# EAGLE design nano_bluetooth4_3.3v (EAGLE 6.1)
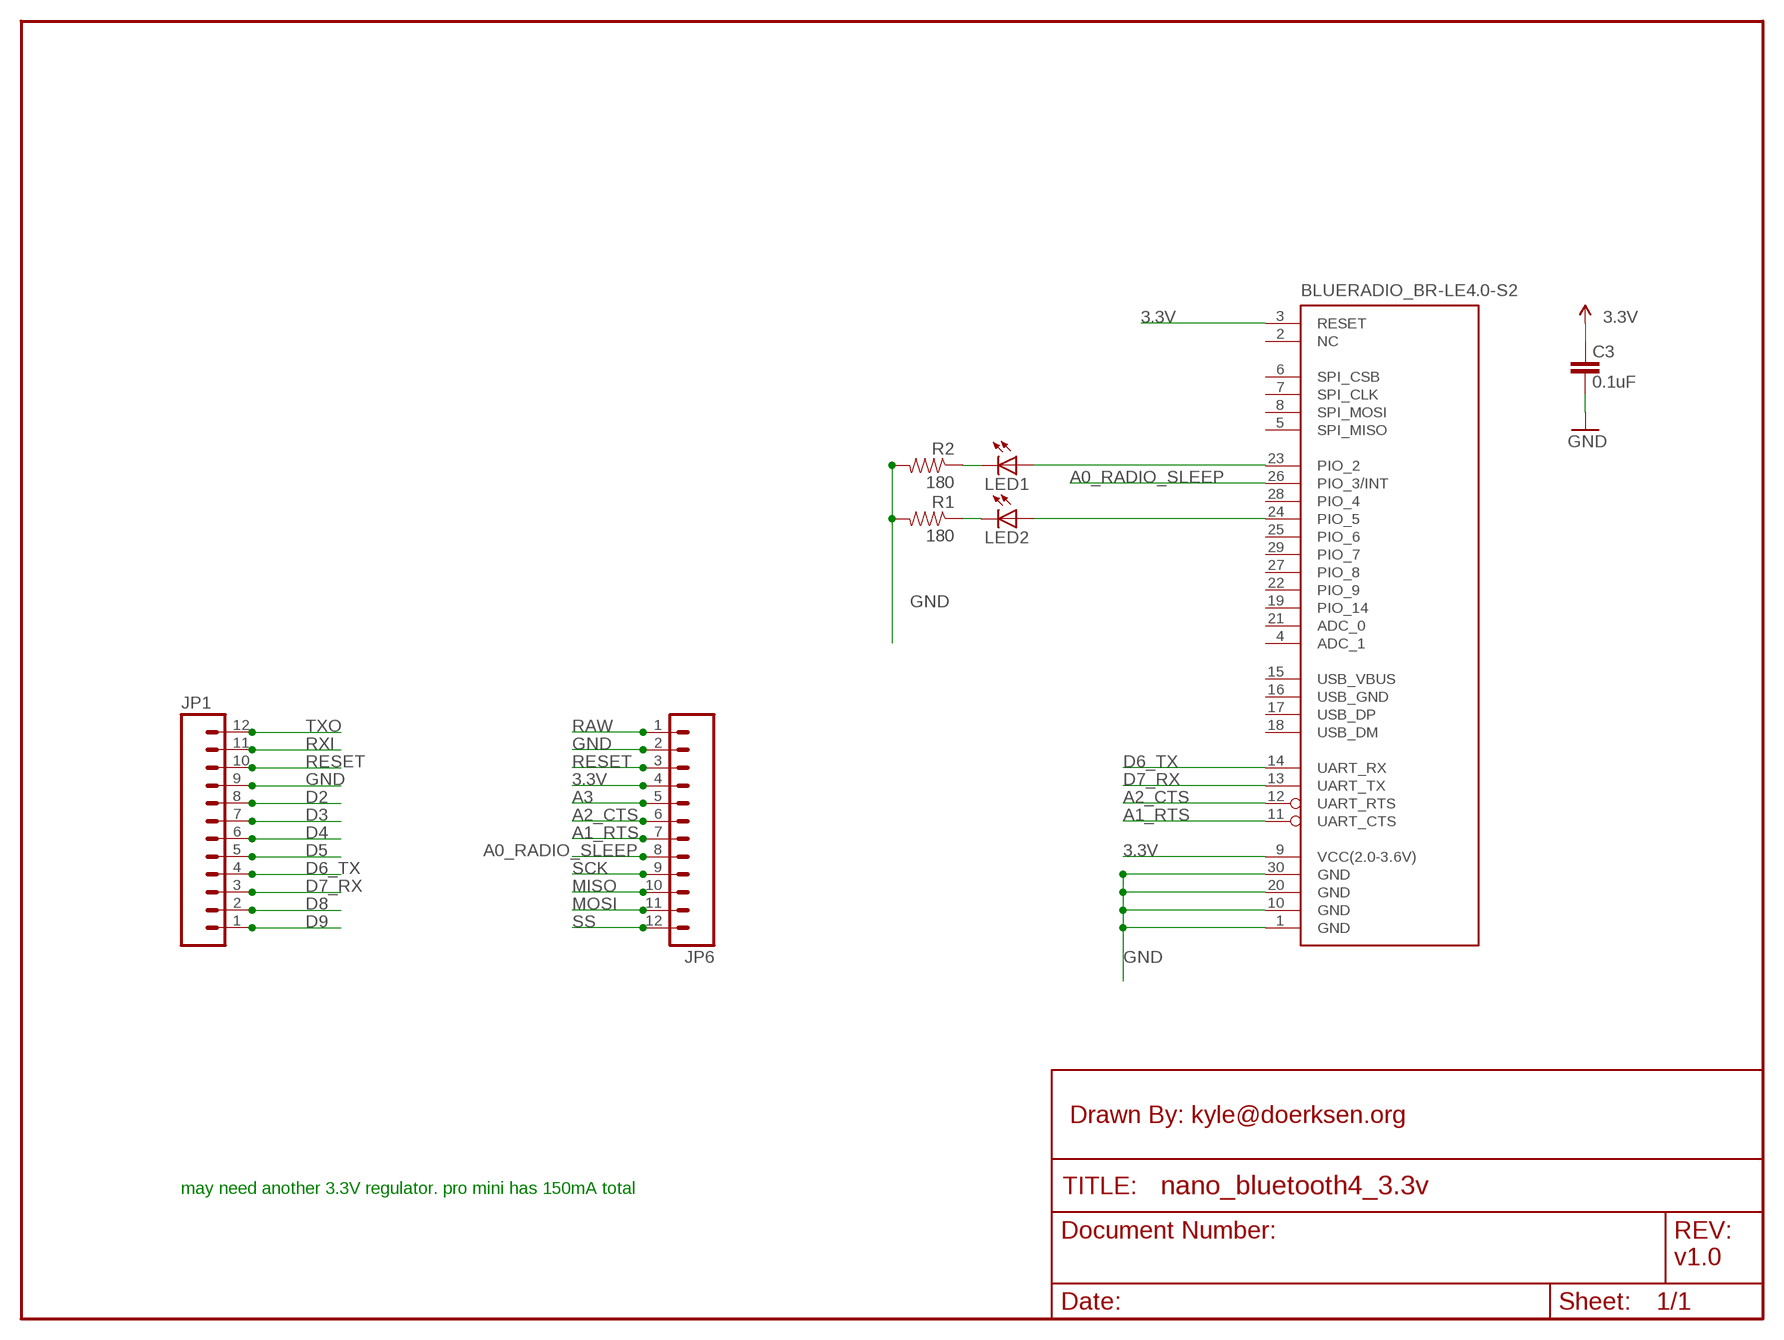
[diagram p0: schematic, sheet 1]

## Parts
BLUERADIO_BR-LE4.0-S2  BLUERADIO_BR-LE4.0-S2  [BLUERADIO_BR-LE4.0-S2]
C3  0.1uF  CAP0402-CAP  [0402-CAP]
JP1  M12PTH  [1X12]
JP6  M12PTH  [1X12]
LED1  LED0603  [LED-0603]
LED2  LED0603  [LED-0603]
R1  180  RESISTOR0402-RES  [0402-RES]
R2  180  RESISTOR0402-RES  [0402-RES]

## Nets
3.3V: BLUERADIO_BR-LE4.0-S2.3(RESET) BLUERADIO_BR-LE4.0-S2.9(VCC(2.0-3.6V)) C3.2 JP6.4 ; supply symbol labelled VCC
A0_RADIO_SLEEP: BLUERADIO_BR-LE4.0-S2.26(PIO_3/INT) JP6.8
A1_RTS: BLUERADIO_BR-LE4.0-S2.11(UART_CTS) JP6.7
A2_CTS: BLUERADIO_BR-LE4.0-S2.12(UART_RTS) JP6.6
A3: JP6.5
D2: JP1.8
D3: JP1.7
D4: JP1.6
D5: JP1.5
D6_TX: BLUERADIO_BR-LE4.0-S2.14(UART_RX) JP1.4
D7_RX: BLUERADIO_BR-LE4.0-S2.13(UART_TX) JP1.3
D8: JP1.2
D9: JP1.1
GND [vcc]: BLUERADIO_BR-LE4.0-S2.1(GND) BLUERADIO_BR-LE4.0-S2.10(GND) BLUERADIO_BR-LE4.0-S2.20(GND) BLUERADIO_BR-LE4.0-S2.30(GND) C3.1 JP1.9 JP6.2 R1.2 R2.2
MISO: JP6.10
MOSI: JP6.11
N$1: BLUERADIO_BR-LE4.0-S2.24(PIO_5) LED2.A
N$2: LED1.C R2.1
N$3: BLUERADIO_BR-LE4.0-S2.23(PIO_2) LED1.A
N$4: LED2.C R1.1
RAW [vcc]: JP6.1
RESET: JP1.10 JP6.3
RXI: JP1.11
SCK: JP6.9
SS: JP6.12
TXO: JP1.12
Unconnected: BLUERADIO_BR-LE4.0-S2.2(NC) BLUERADIO_BR-LE4.0-S2.4(ADC_1) BLUERADIO_BR-LE4.0-S2.5(SPI_MISO) BLUERADIO_BR-LE4.0-S2.6(SPI_CSB) BLUERADIO_BR-LE4.0-S2.7(SPI_CLK) BLUERADIO_BR-LE4.0-S2.8(SPI_MOSI) BLUERADIO_BR-LE4.0-S2.15(USB_VBUS) BLUERADIO_BR-LE4.0-S2.16(USB_GND) BLUERADIO_BR-LE4.0-S2.17(USB_DP) BLUERADIO_BR-LE4.0-S2.18(USB_DM) BLUERADIO_BR-LE4.0-S2.19(PIO_14) BLUERADIO_BR-LE4.0-S2.21(ADC_0) BLUERADIO_BR-LE4.0-S2.22(PIO_9) BLUERADIO_BR-LE4.0-S2.25(PIO_6) BLUERADIO_BR-LE4.0-S2.27(PIO_8) BLUERADIO_BR-LE4.0-S2.28(PIO_4) BLUERADIO_BR-LE4.0-S2.29(PIO_7)

## Notes on the sheet
- Drawn By: kyle@doerksen.org
- may need another 3.3V regulator. pro mini has 150mA total
- v1.0

## Library data of the parts
BLUERADIO_BR-LE4.0-S2 = SparkFun-RF:BLUERADIO_BR-LE4.0-S2
C3 = SparkFun:CAP: Capacitor Standard 0603 ceramic capacitor, and 0.1" leaded capacitor.
JP1 JP6 = SparkFun:M12: Header 12 Standard 12-pin 0.1" header. Use with straight break away headers (SKU : PRT-00116), right angle break away headers (PRT-00553), swiss pins (PRT-00743), machine pins (PRT-00117), and female headers (PRT-00115).
LED1 LED2 = SparkFun-LED:LED: LEDs Standard schematic elements and footprints for 5mm, 3mm, 1206, and 0603 sized LEDs. 5mm - Spark Fun Electronics SKU : COM-00529 (and others)
R1 R2 = SparkFun-Passives:RESISTOR: Resistor Basic schematic elements and footprints for 0603, 1206, and PTH resistors.

## Net classes
1 vcc: width 0.254 mm

## Board
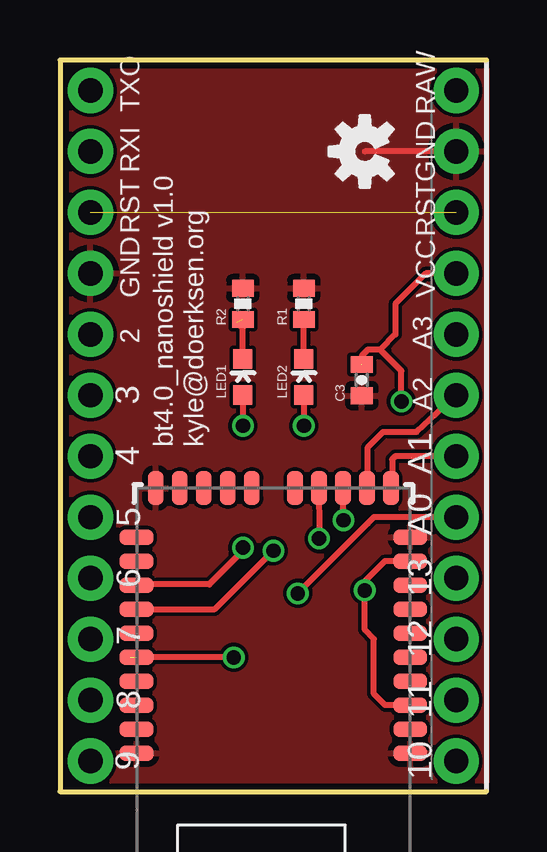
[diagram p1: board, top side]
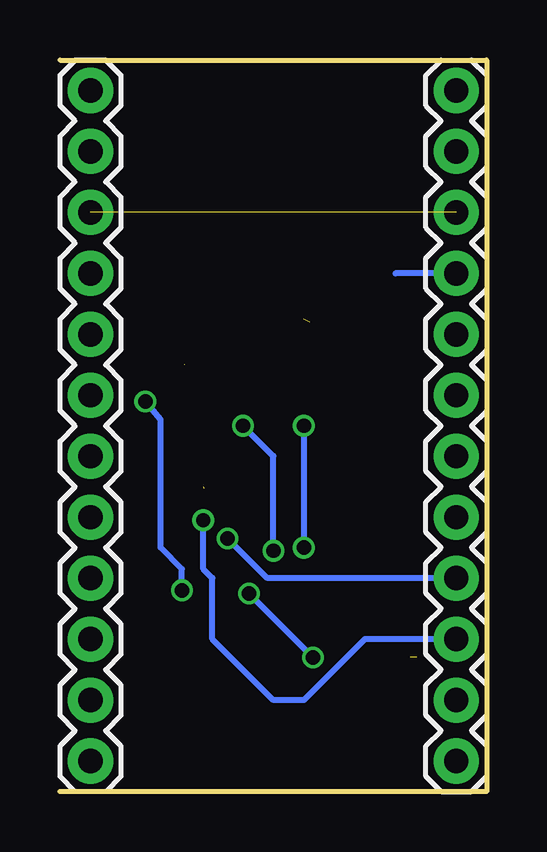
[diagram p2: board, bottom side, seen from below]

Size 17.78 x 30.48 mm. Coordinates in mm from the lower left corner, seen from the top.
Outline: 17.78,0 0,0 0,30.48 17.78,30.48
Copper layers (1*16): Top 0.035mm / dielectric 1.5mm / Bottom 0.035mm
Design rules: minimum track width 6mil, minimum drill 12mil, track to track 6mil, track to pad 6mil, pad to pad 6mil, via to via 6mil, smd to smd 0mil, copper to edge 10mil, drill to drill 10mil, minimum pad ring 10mil, minimum via ring 6mil, stop-mask expansion 2mil, vias tented up to drill 100mil, thermal gap 10mil

### Footprints (pad centres in the part's own frame; a part is rotated, then mirrored left to right if it is on the bottom)
BLUERADIO_BR-LE4.0-S2 = smd 0.65 x 1.4: 1 -4.5,-5.7; 2 -3.5,-5.7; 3 -2.5,-5.7; 4 -1.5,-5.7; 5 -0.5,-5.7; 6 0.5,-5.7; 7 1.5,-5.7; 8 2.5,-5.7; 9 3.5,-5.7; 10 4.5,-5.7; 21 4.5,5.7; 22 3.5,5.7; 23 2.5,5.7; 24 1.5,5.7; 25 0.5,5.7; 26 -0.5,5.7; 27 -1.5,5.7; 28 -2.5,5.7; 29 -3.5,5.7; 30 -4.5,5.7 | smd 1.4 x 0.65: 11 6.55,-4.9; 12 6.55,-3.9; 13 6.55,-2.9; 14 6.55,-1.9; 15 6.55,-0.9; 16 6.55,0.9; 17 6.55,1.9; 18 6.55,2.9; 19 6.55,3.9; 20 6.55,4.9
0402-CAP = smd 0.7 x 0.9: 1 -0.65,0; 2 0.65,0
1X12 = drill 1.016 pad 1.88: 1 0,0; 2 2.54,0; 3 5.08,0; 4 7.62,0; 5 10.16,0; 6 12.7,0; 7 15.24,0; 8 17.78,0; 9 20.32,0; 10 22.86,0; 11 25.4,0; 12 27.94,0
LED-0603 = smd 0.8 x 0.8: A 0,-0.75; C 0,0.75
0402-RES = smd 0.7 x 0.9: 1 -0.65,0; 2 0.65,0

### Placement (x,y rotation side)
BLUERADIO_BR-LE4.0-S2  8.89,6.1 90 top
C3  12.57,17.14 90 top
JP1  1.27,1.27 90 bottom
JP6  16.51,29.21 270 bottom
LED1  7.62,17.27 0 top
LED2  10.16,17.27 0 top
R1  10.16,20.32 90 top
R2  7.62,20.32 90 top
U$2  [OSHW-LOGO-S]  12.7,26.67 90 top

### Tracks (layer width: path | path; a pad name or v marks a point on that pad's centre or on a via)
3.3V  (via drill 0.6)  (1 unrouted)
  Top 0.254: JP6.4 15.24,21.59 13.97,20.32 13.97,19.05 13.34,18.41 | 13.34,18.41 12.83,18.41 12.57,18.16 C3.2 | v14.22,16.26 14.22,17.53 13.34,18.41 | BLUERADIO_BR-LE4.0-S2.9 13.53,9.6 12.7,8.76 v12.7,8.38 12.7,6.73 13.08,6.35 13.08,4.06 13.55,3.6 BLUERADIO_BR-LE4.0-S2.3
  Bottom 0.254: v12.7,8.38 12.7,9.27 13.59,10.16 13.59,15.49 v14.22,16.26
A0_RADIO_SLEEP  (via drill 0.6)  (1 unrouted)
  Top 0.254: v7.24,5.59 2.92,5.59 | JP6.8 13.08,11.43 12.83,11.18 v9.91,8.25
  Bottom 0.254: v9.91,8.25 v7.24,5.59
A1_RTS
  Top 0.254: JP6.7 13.97,13.97 13.84,13.84 13.84,12.72 BLUERADIO_BR-LE4.0-S2.11
A2_CTS
  Top 0.254: BLUERADIO_BR-LE4.0-S2.12 12.83,12.74 12.83,14.35 13.46,14.99 14.86,14.99 JP6.6
D6_TX  (via drill 0.6)
  Top 0.254: BLUERADIO_BR-LE4.0-S2.14 10.79,12.96 v10.79,10.54
  Bottom 0.254: JP1.4 8.89,8.89 9.14,8.89 v10.79,10.54
D7_RX  (via drill 0.6)  (1 unrouted)
  Top 0.254: v11.81,11.3 11.81,12.7
  Bottom 0.254: JP1.3 5.08,6.35 7.62,3.81 8.89,3.81 11.43,6.35 11.43,8.89 11.81,9.27 v11.81,11.3
GND
  Top 0.254: JP6.2 12.7,26.67
  Bottom 0.254: JP1.9 3.81,21.59
  pour Top: 17.78,0 0,0 0,30.48 17.78,30.48
N$1  (via drill 0.6)
  Top 0.254: LED2.A v10.16,15.24 | BLUERADIO_BR-LE4.0-S2.24 6.45,7.6 v8.89,10.03
  Bottom 0.254: v8.89,10.03 8.89,13.97 v10.16,15.24
N$2  (1 unrouted)
  Top 0.254: LED1.C 7.62,19.3 7.37,19.56
N$3  (via drill 0.6)
  Top 0.254: LED1.A v7.62,15.24 | v7.62,10.16 7.62,10.03 6.22,8.64 3.23,8.64 BLUERADIO_BR-LE4.0-S2.23
  Bottom 0.254: v7.62,15.24 v7.62,10.16
N$4
  Top 0.254: LED2.C R1.1
RESET  (1 unrouted)

### Text on the board
tPlace: TXO | RAW | RXI | GND | RST | RST | GND | VCC | 2 | A3 | 3 | A2 | bt4.0_nanoshield v1.0 | kyle@doerksen.org | 4 | A1 | 5 | A0 | 6 | 13 | 7 | 12 | 8 | 11 | 9 | 10
tValues: for use with arduino pro mini 3.3V only!